# EAGLE design MainBoard (EAGLE 6.4)
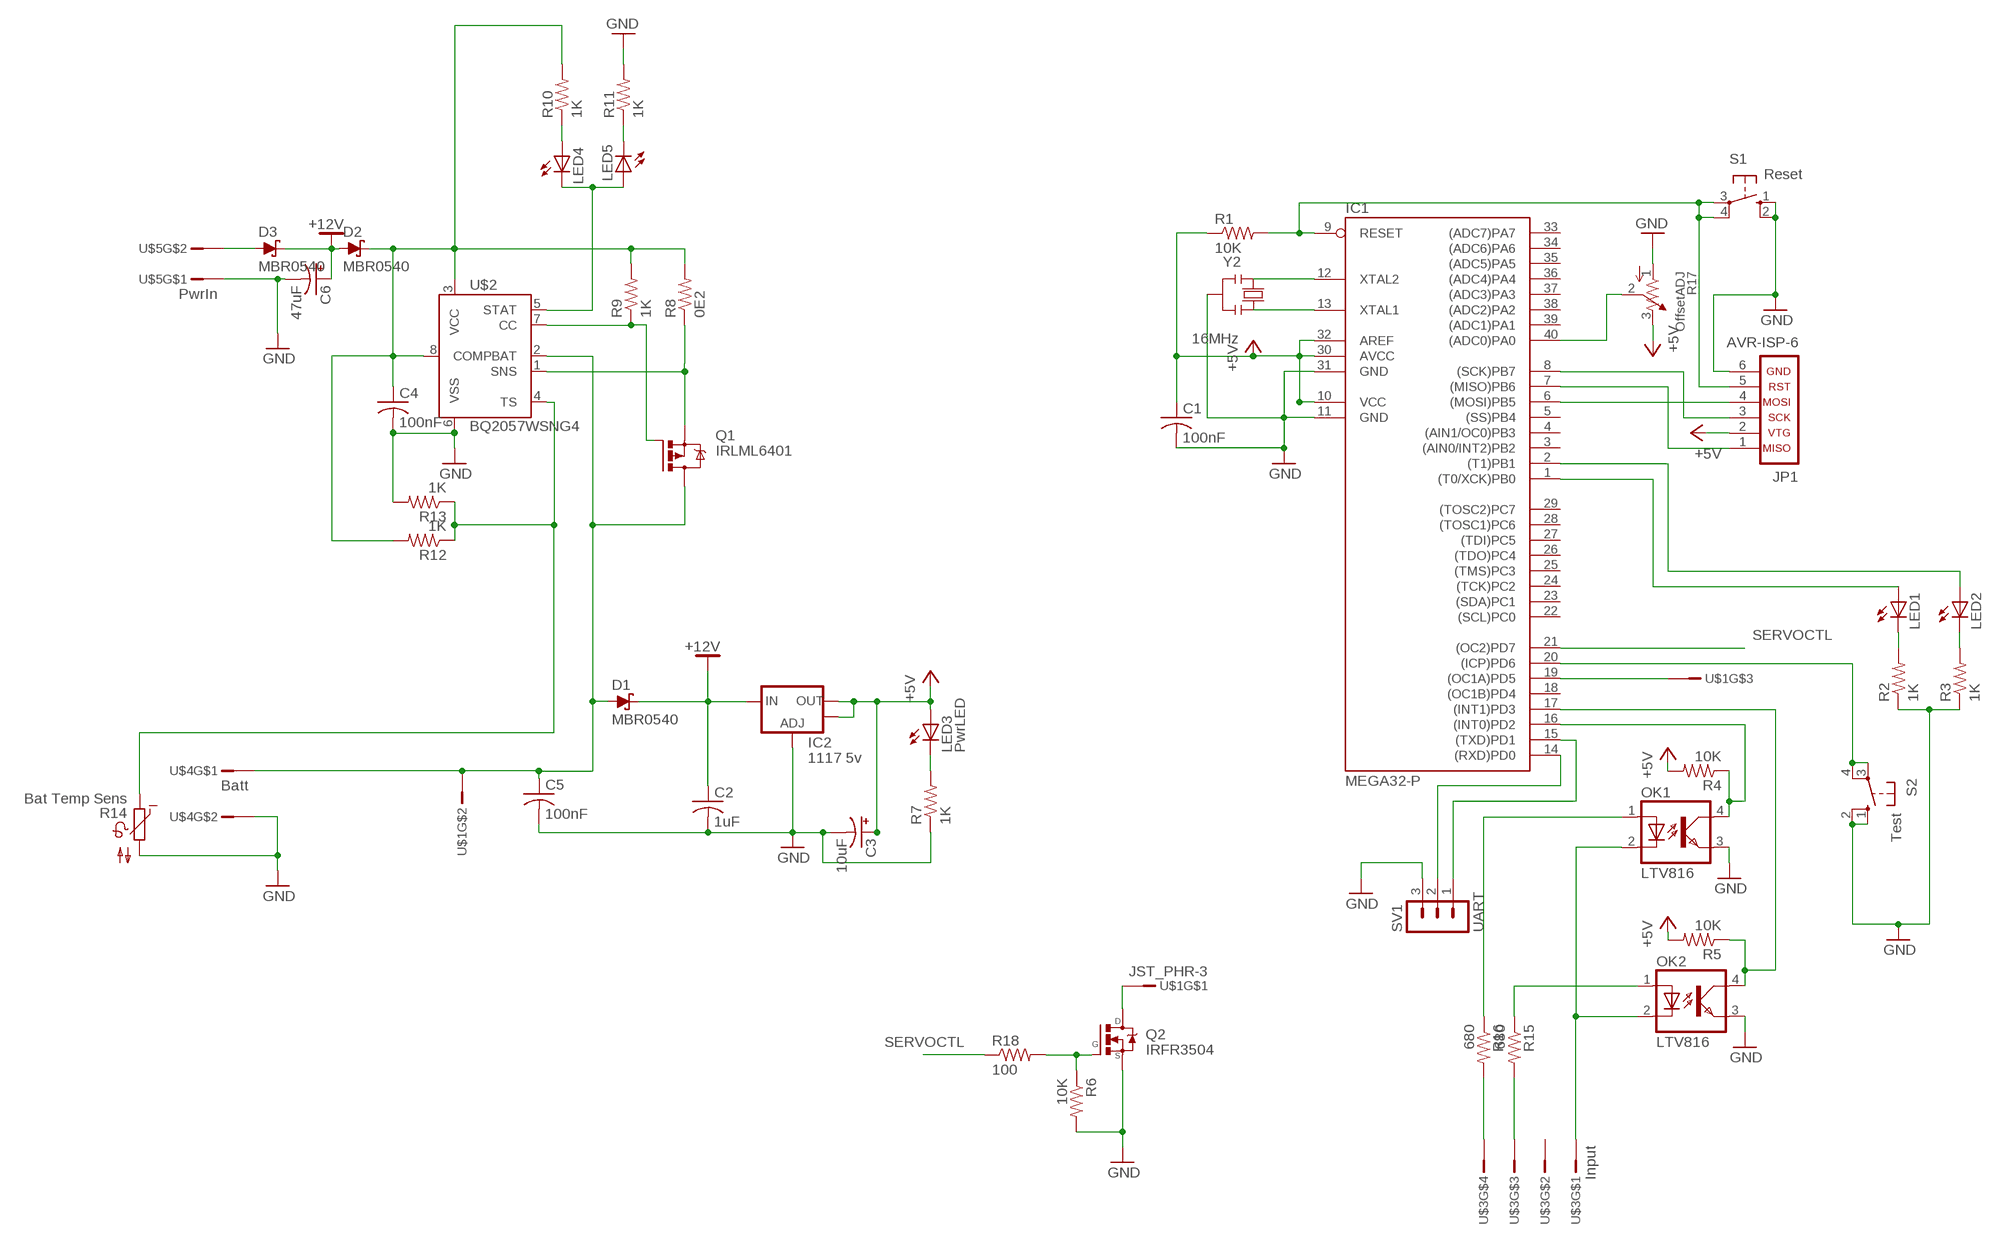
[diagram p0: schematic, sheet 1]

## Parts
C1  100nF  C-USC0805K  [C0805K]
C2  1uF  C-USC0805K  [C0805K]
C3  10uF  CPOL-USE2.5-7  [E2,5-7]
C4  100nF  C-USC0805K  [C0805K]
C5  100nF  C-USC0805K  [C0805K]
C6  47uF  CPOL-USE2.5-7  [E2,5-7]
D1  MBR0540  [SOD123]
D2  MBR0540  [SOD123]
D3  MBR0540  [SOD123]
IC1  MEGA32-P  [DIL40]
IC2  1117 5v  V_REG_LM1117SOT223  [SOT223]
JP1  AVR-ISP-6  [AVR-ISP-6]
LED1  LED3MM  [LED3MM]
LED2  LED3MM  [LED3MM]
LED3  PwrLED  LED3MM  [LED3MM]
LED4  LED3MM  [LED3MM]
LED5  LED3MM  [LED3MM]
OK1  LTV816  [DIL04]
OK2  LTV816  [DIL04]
Q1  IRLML6401  IRLML5203  [MICRO3]
Q2  IRFR3504  [DPAK]
R1  10K  R-US_R0805  [R0805]
R2  1K  R-US_R0805  [R0805]
R3  1K  R-US_R0805  [R0805]
R4  10K  R-US_R0805  [R0805]
R5  10K  R-US_R0805  [R0805]
R6  10K  R-US_R0805  [R0805]
R7  1K  R-US_R0805  [R0805]
R8  0E2  R-US_M1206  [M1206]
R9  1K  R-US_R0805  [R0805]
R10  1K  R-US_R0805  [R0805]
R11  1K  R-US_R0805  [R0805]
R12  1K  R-US_R0805  [R0805]
R13  1K  R-US_R0805  [R0805]
R14  Bat Temp Sens  NTC640  [P640]
R15  680  R-US_R0805  [R0805]
R16  680  R-US_R0805  [R0805]
R17  OffsetADJ  3362P  [3362P]
R18  100  R-US_R0805  [R0805]
S1  Reset  10-XX  [B3F-10XX]
S2  Test  10-XX  [B3F-10XX]
SV1  UART  MA03-1  [MA03-1]
U$1  JST_PHR-3  [PHR-3]
U$2  BQ2057WSNG4  [D_R-PDSO-G8]
U$3  Input  JST_PHR-4  [PHR-4]
U$4  Batt  JST_PHR-2  [PHR-2]
U$5  PwrIn  JST_PHR-2  [PHR-2]
Y2  16MHz  RESONATORMU  [RESONATOR]

## Nets
+5V: C1.1 C3.+ IC1.10(VCC) IC1.30(AVCC) IC1.32(AREF) IC2.2(OUT) IC2.4(OUT) JP1.2 LED3.A R1.1 R4.2 R5.2 R17.3
+12V: C2.1 C6.+ D1.C D2.A D3.C IC2.3(IN)
GND: C1.2 C2.2 C3.- C4.2 C5.2 C6.- IC1.11(GND) IC1.31(GND) IC2.1(ADJ) JP1.6 OK1.3(EMIT) OK2.3(EMIT) Q2.3(S) R2.1 R3.1 R6.2 R7.1 R11.2 R13.2 R14.2 R17.1 S1.1(S) S1.2(S1) S2.1(S) S2.2(S1) SV1.3 U$2.6(VSS) U$4.P$2 U$5.P$1 Y2.2
N$1: OK1.2(C) OK2.2(C) U$3.P$1
N$2: IC1.9(RESET) JP1.5 R1.2 S1.3(P) S1.4(P1)
N$3: IC1.8((SCK)PB7) JP1.3
N$4: IC1.6((MOSI)PB5) JP1.4
N$5: IC1.7((MISO)PB6) JP1.1
N$6: D3.A U$5.P$2
N$7: IC1.15((TXD)PD1) SV1.1
N$8: LED4.K(C) LED5.A U$2.5(STAT)
N$9: IC1.13(XTAL1) Y2.3
N$10: IC1.12(XTAL2) Y2.1
N$11: IC1.19((OC1A)PD5) U$1.P$3
N$12: LED1.K(C) R2.2
N$13: LED2.K(C) R3.2
N$14: IC1.14((RXD)PD0) SV1.2
N$15: IC1.1((T0/XCK)PB0) LED1.A
N$16: IC1.40((ADC0)PA0) R17.2
N$17: IC1.2((T1)PB1) LED2.A
N$18: LED3.K(C) R7.2
N$19: IC1.20((ICP)PD6) S2.3(P) S2.4(P1)
N$20: C5.1 D1.A Q1.3(D) U$1.P$2 U$2.2(BAT) U$4.P$1
N$21: Q2.1(G) R6.1 R18.2
N$22: Q2.4(D) U$1.P$1
N$27: Q1.2(S) R8.1 U$2.1(SNS)
N$29: Q1.1(G) R9.1 U$2.7(CC)
N$30: LED5.K(C) R11.1
N$31: LED4.A R10.1
N$32: R12.1 R13.1 R14.1 U$2.4(TS)
N$33: R16.2 U$3.P$4
N$34: C4.1 D2.C R8.2 R9.2 R10.2 R12.2 U$2.3(VCC) U$2.8(COMP)
N$35: IC1.17((INT1)PD3) OK2.4(COL) R5.1
N$36: IC1.16((INT0)PD2) OK1.4(COL) R4.1
N$37: R15.2 U$3.P$3
N$39: OK1.1(A) R16.1
N$40: OK2.1(A) R15.1
SERVOCTL: IC1.21((OC2)PD7) R18.1
Unconnected: IC1.3((AIN0/INT2)PB2) IC1.4((AIN1/OC0)PB3) IC1.5((SS)PB4) IC1.18((OC1B)PD4) IC1.22((SCL)PC0) IC1.23((SDA)PC1) IC1.24((TCK)PC2) IC1.25((TMS)PC3) IC1.26((TDO)PC4) IC1.27((TDI)PC5) IC1.28((TOSC1)PC6) IC1.29((TOSC2)PC7) IC1.33((ADC7)PA7) IC1.34((ADC6)PA6) IC1.35((ADC5)PA5) IC1.36((ADC4)PA4) IC1.37((ADC3)PA3) IC1.38((ADC2)PA2) IC1.39((ADC1)PA1) U$3.P$2

## Library data of the parts
C1 C2 C4 C5 = resistor:C-US: CAPACITOR, American symbol
C3 C6 = resistor:CPOL-US: POLARIZED CAPACITOR, American symbol
D1-D3 = diode:MBR0540: schottky diode, 0.5A, 40V ON Semiconductor
IC1 = atmel:MEGA32-P: MICROCONTROLLER 32 Kbytes FLASH 2 Kbytes SRAM 1 Kbytes EEPROM USART 8-channel 10 bit ADC Source: www.atmel.com .. doc2503.pdf; MPN: ATMEGA32-16PU; OC_FARNELL: 1661729; OC_NEWARK: 51P1794
IC2 = SparkFun:V_REG_LM1117: Voltage Regulator LM1117 Standard adjustable voltage regulator but in SMD form. Spark Fun Electronics SKU : COM-00595
JP1 = atmel:AVR-ISP-6: AVR ISP-6 Serial Programming Header
LED1-LED5 = led:LED: LED OSRAM: - CHIPLED LG R971, LG N971, LY N971, LG Q971, LY Q971, LO R971, LY R971 LH N974, LH R974 LS Q976, LO Q976, LY Q976 LO Q996 - Hyper CHIPLED LW Q18S LB Q993, LB Q99A, LB R99A - SideLED LS A670, LO A670, LY A670, LG A670, LP A670 LB A673, LV A673, LT A673, LW A673 LH A674 LY A675 LS A676, LA A676, LO A676, LY A676, LW A676 LS A679, LY A679, LG A679 - Hyper Micro SIDELED® LS Y876, LA Y876, LO Y876, LY Y876 LT Y87S - SmartLED LW L88C, LW L88S LB L89C, LB L89S, LG L890 LS L89K, LO L89K, LY L89K LS L896, LA L896, LO L896, LY L896 - TOPLED LS T670, LO T670, LY T670, LG T670, LP T670 LSG T670, LSP T670, LSY T670, LOP T670, LYG T670 LG T671, LOG T671, LSG T671 LB T673, LV T673, LT T673, LW T673 LH T674 LS T676, LA T676, LO T676, LY T676, LB T676, LH T676, LSB T676, LW T676 LB T67C, LV T67C, LT T67C, LS T67K, LO T67K, LY T67K, LW E67C LS E67B, LA E67B, LO E67B, LY E67B, LB E67C, LV E67C, LT E67C LW T67C LS T679, LY T679, LG T679 LS T770, LO T770, LY T770, LG T770, LP T770 LB T773, LV T773, LT T773, LW T773 LH T774 LS E675, LA E675, LY E675, LS T675 LS T776, LA T776, LO T776, LY T776, LB T776 LHGB T686 LT T68C, LB T68C - Hyper Mini TOPLED® LB M676 - Mini TOPLED Santana® LG M470 LS M47K, LO M47K, LY M47K Source: http://www.osram.convergy.de LUXEON: - LUMILED® LXK2-PW12-R00, LXK2-PW12-S00, LXK2-PW14-U00, LXK2-PW14-V00 LXK2-PM12-R00, LXK2-PM12-S00, LXK2-PM14-U00 LXK2-PE12-Q00, LXK2-PE12-R00, LXK2-PE12-S00, LXK2-PE14-T00, LXK2-PE14-U00 LXK2-PB12-K00, LXK2-PB12-L00, LXK2-PB12-M00, LXK2-PB14-N00, LXK2-PB14-P00, LXK2-PB14-Q00 LXK2-PR12-L00, LXK2-PR12-M00, LXK2-PR14-Q00, LXK2-PR14-R00 LXK2-PD12-Q00, LXK2-PD12-R00, LXK2-PD12-S00 LXK2-PH12-R00, LXK2-PH12-S00 LXK2-PL12-P00, LXK2-PL12-Q00, LXK2-PL12-R00 Source: www.luxeon.com KINGBRIGHT: KA-3528ASYC Source: www.kingbright.com
OK1 OK2 = optocoupler:LTV816: OPTO COUPLER Source: LITEON, LTV816.pdf; OC_FARNELL: unknown; OC_NEWARK: unknown
Q1 = transistor-power:IRLML5203: HEXFET P-Channel Power MOSFET
Q2 = transistor-fet:IRFR3504: N-Channel HEXFET
R1-R13 R15 R16 R18 = resistor:R-US_: RESISTOR, American symbol
R14 = ptc-ntc:NTC640: PHILIPS NTC; OC_FARNELL: unknown; OC_NEWARK: unknown
R17 = bourns:3362: 3362 Series 1/4" Square Trimmer
S1 S2 = switch-omron:10-XX: OMRON SWITCH; MPN: B3F-1000; OC_FARNELL: 176432; OC_NEWARK: 36M3542
SV1 = con-lstb:MA03-1: PIN HEADER; OC_FARNELL: unknown; OC_NEWARK: unknown
U$1 = RobThePyro:JST_PHR-3
U$2 = RobThePyro:BQ2057WSNG4: TI BQ2057WSNG4 1-2Cell Li-ion / lipo charger IC http://www.ti.com/lit/ds/symlink/bq2057w.pdf
U$3 = RobThePyro:JST_PHR-4
U$4 U$5 = RobThePyro:JST_PHR-2
Y2 = SmartPrj:RESONATOR

## Net classes
0 default: width 0.152 mm, drill 0.305 mm, clearance 0.152 mm

## Board
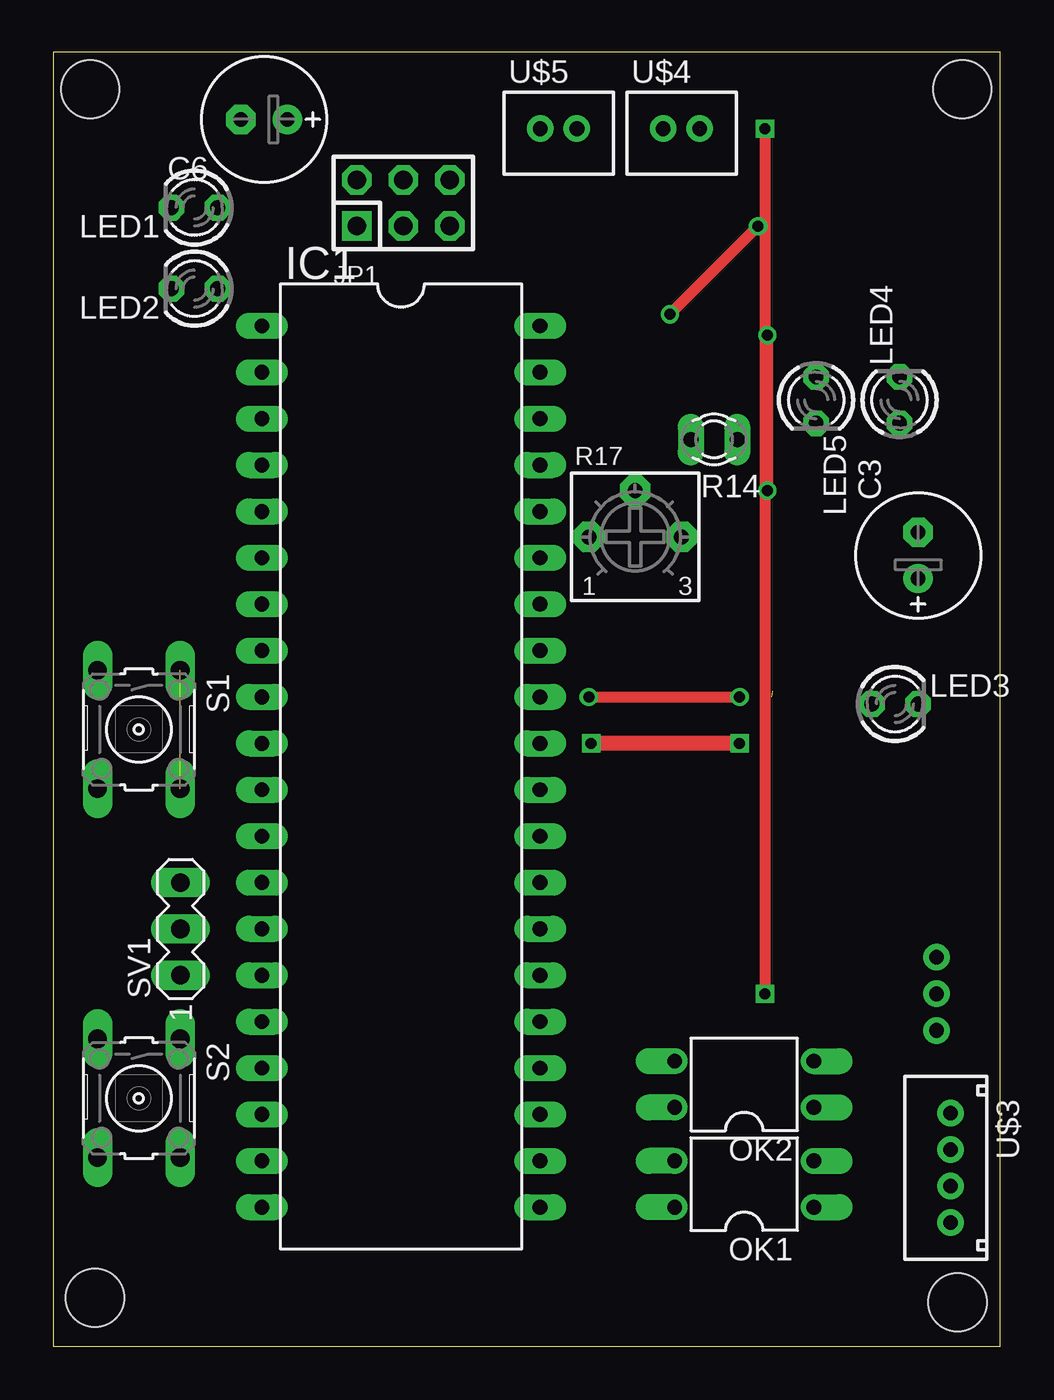
[diagram p1: board, top side]
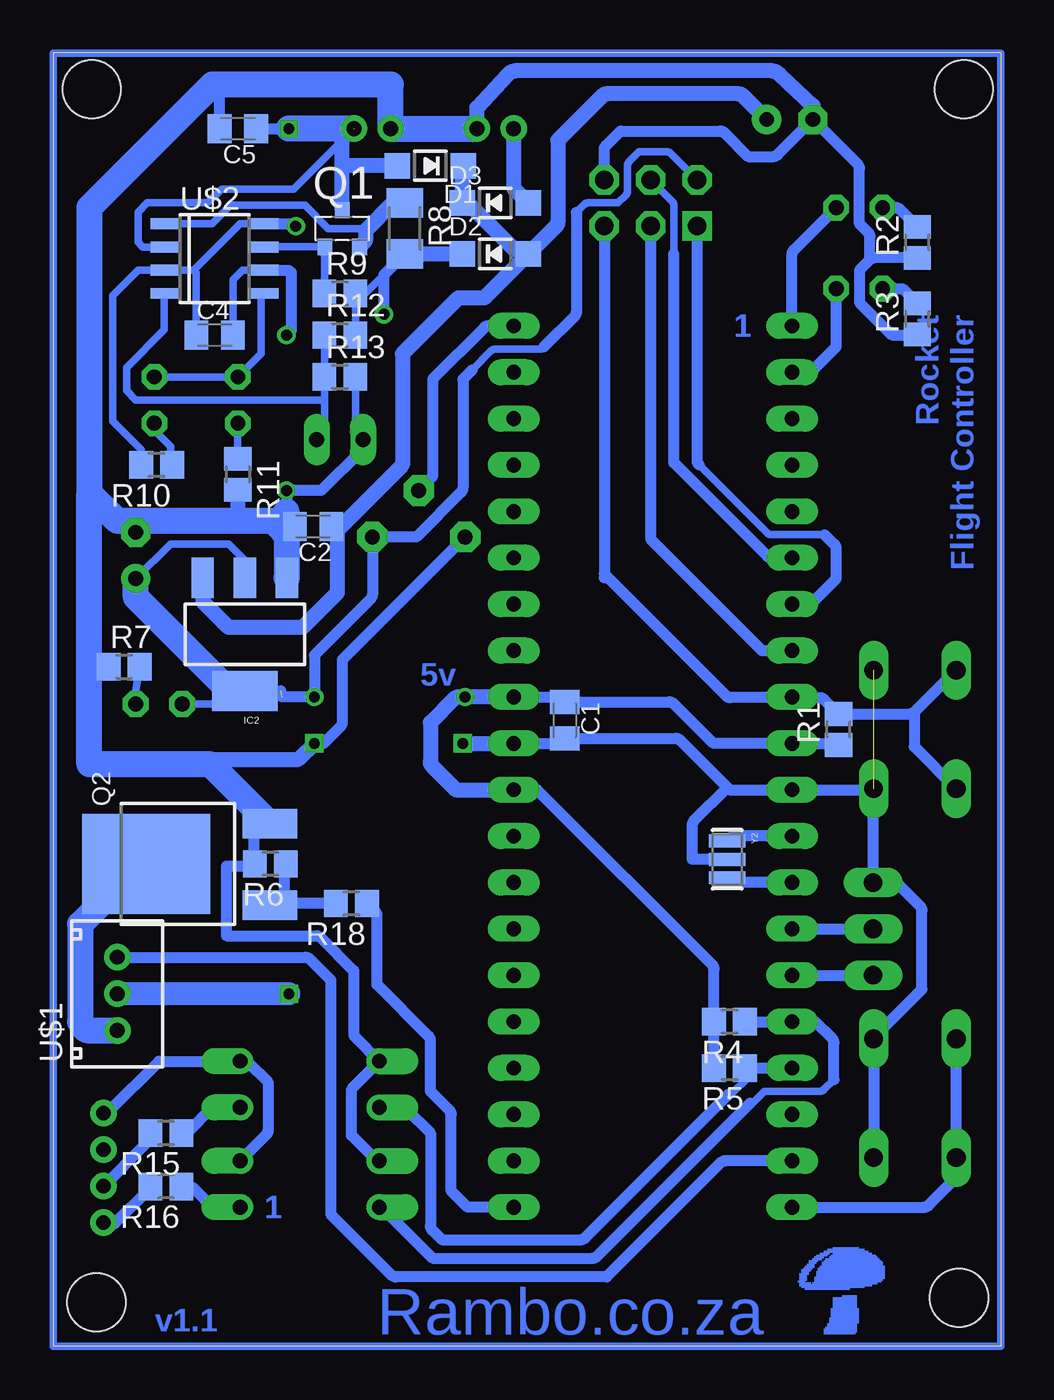
[diagram p2: board, bottom side, seen from below]

Size 51.87 x 70.86 mm. Coordinates in mm from the lower left corner, seen from the top.
Outline: 0,0 51.87,0 51.87,70.86 0,70.86 0,0
Copper layers (1*16): Top 0.035mm / dielectric 1.5mm / Bottom 0.035mm
Design rules "default *": minimum track width 10mil, minimum drill 24mil, track to track 8mil, track to pad 8mil, pad to pad 8mil, via to via 8mil, smd to smd 8mil, copper to edge 40mil, drill to drill 8mil, minimum pad ring 0.3mm, minimum via ring 8mil, stop-mask expansion 4mil, vias tented up to drill 0mil, thermal gap 10mil
Holes 3.2 mm at 2.03,68.83 49.78,68.83 2.29,2.67 49.53,2.41

### Footprints (pad centres in the part's own frame; a part is rotated, then mirrored left to right if it is on the bottom)
C0805K = smd 1.3 x 1.6: 1 -1,0; 2 1,0
E2,5-7 = drill 0.813 pad 1.6: + -1.27,0 | drill 0.813 pad 1.6 octagon: - 1.27,0
SOD123 = smd 1.4 x 1.4: A 1.805,0; C -1.805,0
DIL40 = drill 0.813 long: 1 -24.13,-7.62; 2 -21.59,-7.62; 3 -19.05,-7.62; 4 -16.51,-7.62; 5 -13.97,-7.62; 6 -11.43,-7.62; 7 -8.89,-7.62; 8 -6.35,-7.62; 9 -3.81,-7.62; 10 -1.27,-7.62; 11 1.27,-7.62; 12 3.81,-7.62; 13 6.35,-7.62; 14 8.89,-7.62; 15 11.43,-7.62; 16 13.97,-7.62; 17 16.51,-7.62; 18 19.05,-7.62; 19 21.59,-7.62; 20 24.13,-7.62; 21 24.13,7.62; 22 21.59,7.62; 23 19.05,7.62; 24 16.51,7.62; 25 13.97,7.62; 26 11.43,7.62; 27 8.89,7.62; 28 6.35,7.62; 29 3.81,7.62; 30 1.27,7.62; 31 -1.27,7.62; 32 -3.81,7.62; 33 -6.35,7.62; 34 -8.89,7.62; 35 -11.43,7.62; 36 -13.97,7.62; 37 -16.51,7.62; 38 -19.05,7.62; 39 -21.59,7.62; 40 -24.13,7.62
SOT223 = smd 1.219 x 2.235: 1 -2.311,-3.099; 2 0,-3.099; 3 2.311,-3.099 | smd 3.6 x 2.2: 4 0,3.099
AVR-ISP-6 = drill 1.016 square: 1 -2.54,-1.27 | drill 1.016 octagon: 2 -2.54,1.27; 3 0,-1.27; 4 0,1.27; 5 2.54,-1.27; 6 2.54,1.27
LED3MM = drill 0.813 octagon: A -1.27,0; K 1.27,0
DIL04 = drill 0.813 offset: 1 -1.27,-3.81; 2 1.27,-3.81; 3 1.27,3.81; 4 -1.27,3.81
MICRO3 = smd 0.8 x 0.9: 1 -0.95,-1; 2 0.95,-1; 3 0,1
DPAK = smd 1.6 x 2.997: 1 -2.261,-4.928; 3 2.21,-4.928 | smd 5.452 x 7: 4 0,1.853
R0805 = smd 1.3 x 1.5: 1 -0.85,0; 2 0.85,0
M1206 = smd 1.6 x 2: 1 -1.4,0; 2 1.4,0
P640 = drill 0.813 long: 1 -1.27,0; 2 1.27,0
3362P = drill 0.813 pad 1.676 octagon: 1 -2.54,0; 2 0,2.54; 3 2.54,0
B3F-10XX = drill 1.016 long: 1 -3.251,2.261; 2 3.251,2.261; 3 -3.251,-2.261; 4 3.251,-2.261
MA03-1 = drill 1.016 long: 1 -2.54,0; 2 0,0; 3 2.54,0
PHR-3 = drill 0.8 pad 1.45: P$1 -2,0; P$2 0,0; P$3 2,0
D_R-PDSO-G8 = smd 0.6 x 1.5: 1 -1.905,-2.75; 2 -0.635,-2.75; 3 0.635,-2.75; 4 1.905,-2.75; 5 1.905,2.75; 6 0.635,2.75; 7 -0.635,2.75; 8 -1.905,2.75
PHR-4 = drill 0.8 pad 1.45: P$1 -3,0.5; P$2 -1,0.5; P$3 1,0.5; P$4 3,0.5
PHR-2 = drill 0.8 pad 1.45: P$1 1,0; P$2 -1,0
RESONATOR = smd 0.7 x 2: 1 -1,0; 2 0,0; 3 1,0

### Placement (x,y rotation side)
C1  23.88,34.29 270 bottom
C2  37.66,44.89 180 bottom
C3  47.37,43.31 90 top
C4  43.05,55.37 0 bottom
C5  41.78,66.67 180 bottom
C6  11.56,67.18 180 top
D1  31.24,64.64 180 bottom
D2  27.69,59.82 0 bottom
D3  27.69,62.61 0 bottom
IC1  19.05,31.75 270 top
IC2  41.4,38.99 180 bottom
JP1  19.18,62.61 0 top
LED1  7.75,62.36 180 top
LED2  7.75,57.91 180 top
LED3  46.1,35.18 0 top
LED4  46.35,51.82 90 top
LED5  41.78,51.82 270 top
OK1  37.85,8.89 90 top
OK2  37.85,14.35 90 top
Q1  36.07,61.21 0 bottom
Q2  44.96,26.42 90 bottom
R1  8.89,33.78 90 bottom
R2  4.57,60.45 90 bottom
R3  4.57,56.26 90 bottom
R4  14.86,17.78 180 bottom
R5  14.86,15.24 180 bottom
R6  40.01,26.42 180 bottom
R7  48.01,37.21 0 bottom
R8  32.64,61.21 270 bottom
R9  36.2,57.66 0 bottom
R10  46.23,48.26 180 bottom
R11  41.78,47.75 270 bottom
R12  36.2,55.37 0 bottom
R13  36.2,53.09 0 bottom
R14  36.2,49.66 180 top
R15  45.72,11.68 180 bottom
R16  45.72,8.76 180 bottom
R17  31.88,44.32 0 top
R18  35.56,24.26 180 bottom
S1  4.7,33.78 270 top
S2  4.7,13.59 270 top
SV1  6.99,22.86 90 top
U$1  48.39,19.3 90 bottom
U$2  43.05,59.56 270 bottom
U$3  48.64,9.78 270 top
U$4  34.42,66.67 0 top
U$5  27.69,66.67 0 top
Y2  14.99,26.67 270 bottom

### Tracks (layer width: path | path; a pad name or v marks a point on that pad's centre or on a via)
+5V  (via drill 0.6)  (1 unrouted)
  Top 0.61: v29.34,35.56 v37.59,35.56
  Bottom 0.406: 27.94,35.56 IC1.32 | 24.13,35.54 C1.1 24.15,35.56 | IC2.2 41.4,43.05 42.29,43.94 45.47,43.94 C3.+ | LED3.A 42.11,35.18 IC2.4 | JP1.2 18.07,65.31 arc-45 18.29,65.41 19.81,65.41 20.35,64.86 arc-45 20.45,64.64 20.45,63.25 arc45 20.54,63.03 20.95,62.61 22.6,62.61 arc-45 22.83,62.52 23.24,62.1 | 28.96,53.47 27.91,54.52 arc45 27.68,54.61 25.15,54.61 25.02,54.74
  Bottom 0.61: IC2.4 39.42,35.89 | 27.94,35.56 v29.34,35.56 29.21,35.43 | 39.37,35.56 v37.59,35.56 37.59,37.85 34.51,40.93 arc-45 34.42,41.15 R17.3 32,44.32 29.56,46.77 arc-45 29.46,46.99 29.46,52.96 28.96,53.47 | R5.2 R4.2 15.71,20.66 arc-45 15.8,20.88 25.4,30.48 IC1.30 | R1.1 arc-45 9.1,33.02 IC1.10 15.62,33.02 arc45 15.84,33.11 17.93,35.2 arc-45 18.15,35.29 C1.1 24.05,35.47 arc-45 24.28,35.56 IC1.32 | 23.24,62.1 23.24,56.65 arc45 23.33,56.42 25.02,54.74
  Bottom 0.813: IC1.32 29.71,35.56 arc-45 29.94,35.47 31.24,34.16 31.24,32.01 arc-45 31.15,31.78 29.84,30.48 IC1.30
  Bottom 1.422: IC2.4 42.24,35.89 47.37,41.02 C3.+
+12V
  Bottom 0.406: C2.1 36.51,44.9 36.32,44.7
  Bottom 0.813: D2.A 26.14,60.07 26.67,60.07 29.21,62.61 D3.C 29.49,64.59 D1.C | 43.71,42.06 IC2.3 43.69,42.06 43.69,40.77 42.29,39.37 38.23,39.37 36.32,41.27 36.32,44.7 32.77,48.26 32.77,54.36 29.72,57.4 28.29,57.4 D2.A | D2.A 24.35,61.35 arc-45 24.26,61.57 24.26,66.04 21.81,68.49 arc45 21.59,68.58 14.36,68.58 arc45 14.13,68.49 C6.+
GND  (via drill 0.6)  (1 unrouted)
  Top 0.61: v39.12,55.37 v39.12,46.86
  Top 0.813: v37.59,33.02 v29.46,33.02
  Bottom 0.406: 24.15,33.02 C1.2 | U$2.6 41.53,58.93 42.04,58.42 42.04,55.39 C4.2 | R13.2 35.34,50.08 | 39.16,46.9 v39.12,46.86 | C2.2 39.05,44.9 39.31,44.64
  Bottom 0.61: U$2.6 38.99,58.93 38.86,58.8 38.86,55.63 v39.12,55.37 | 39.12,45.72 v39.12,46.86 37.21,46.86 35.02,49.06 arc-45 34.92,49.28 R14.2 35.34,50.08 | JP1.6 21.72,65.53 arc45 21.62,65.75 20.83,66.55 15.37,66.55 arc45 15.15,66.45 13.84,65.15 12.45,65.15 arc-45 12.23,65.24 C6.- 7.84,64.74 arc45 7.75,64.51 7.75,61.47 7.26,60.98 arc45 7.17,60.76 7.17,59.51 | C5.2 42.78,68.84 arc45 42.69,69.07 42.67,69.09 | 24.28,33.02 arc-45 24.05,33.11 | R2.1 6.94,59.6 arc-45 7.17,59.51 | 7.17,59.51 7.75,58.93 7.75,57.28 arc-45 7.65,57.06 5.97,55.37 4.67,55.37 arc-45 R3.1 | OK1.3 arc45 34.25,10.25 35.56,11.56 35.56,13.96 arc45 35.47,14.19 OK2.3 35.34,16.93 arc45 35.43,17.15 35.43,20.57 37.24,22.39 arc-45 37.47,22.48 42.42,22.48 42.42,26.29 41.11,26.29 arc-45 40.89,26.38 R6.2 arc45 40.89,26.51 40.89,28.32 40.68,28.53 arc45 40.46,28.63 Q2.3 | 43.43,32.13 arc-45 43.65,32.04 43.81,31.88 | IC1.31 24.28,33.02 | 24.28,33.02 arc-45 24.05,33.11 | 24.05,33.11 C1.2 17.8,33.29 arc45 17.58,33.2 14.99,30.61 | 14.99,30.61 14.86,30.48 IC1.11 7.08,30.48 arc-45 S1.2 arc-45 6.99,30.47 SV1.3 5.71,25.4 4.41,24.1 arc45 4.32,23.87 4.32,19.56 6.91,16.97 arc-45 S2.1 S2.2 | R17.1 36.07,37.59 36.07,34.17 arc45 36.16,33.94 37.08,33.02 v37.59,33.02 | Y2.2 16.89,26.67 16.89,28.57 arc45 16.8,28.8 14.99,30.61
  Bottom 0.813: R11.2 41.78,45.34 41.66,45.21 | U$5.P$1 28.69,67.83 27.02,69.63 arc45 26.54,69.85 12.58,69.85 arc45 12.1,69.63 10.29,67.94 C6.- | R7.1 49.91,37.21 | 43.43,32.13 38.61,32.13 arc-45 38.39,32.22 v37.59,33.02 | v29.46,33.02 IC1.31
  Bottom 1.422: 39.18,44.51 39.31,44.64 39.88,45.21 41.66,45.21 46.99,45.21 | 39.18,44.51 39.12,44.45 39.12,42.11 IC2.1 | 39.12,45.72 39.12,44.58 39.18,44.51 | 46.99,45.21 48.39,45.21 49.91,46.74 | C3.- 47.37,44.83 46.99,45.21 | 49.91,46.74 49.91,62.36 43.18,69.09 42.67,69.09 33.4,69.09 33.42,69.07 U$4.P$2 U$5.P$1 | Q2.3 43.19,31.78 arc-45 43.41,31.88 43.81,31.88 49.91,31.88 49.91,37.21 49.91,46.74
N$1
  Bottom 0.61: OK1.2 40.23,11.59 arc-45 40.13,11.82 40.13,14.48 41.18,15.53 arc-45 41.41,15.62 OK2.2 46.1,15.62 48.85,12.87 arc45 49.08,12.78 U$3.P$1
N$2
  Bottom 0.61: JP1.5 21.72,42.29 | 21.72,42.29 21.72,42.08 | 11.52,35.52 arc-45 IC1.9 | 11.52,35.52 9.91,35.52 arc45 9.69,35.43 R1.2 4.97,34.63 arc-45 4.75,34.73 | 4.75,34.73 S1.3 | 11.52,35.52 14.81,35.52 arc45 15.04,35.61 21.72,42.29 | 4.75,34.73 4.75,32.84 S1.4
N$3
  Bottom 0.61: JP1.3 19.18,44.33 arc-45 19.08,44.1 13.08,38.1 IC1.8
N$4
  Bottom 0.406: 17.91,59.82 17.91,62.48 arc-45 18,62.7 JP1.4
  Bottom 0.61: IC1.6 12.57,43.18 arc45 12.79,43.27 17.91,48.39 17.91,59.82
N$5
  Bottom 0.406: 9.65,44.45 12.57,44.45 arc45 12.79,44.54 16.51,48.26
  Bottom 0.61: JP1.1 16.64,48.52 arc-45 16.54,48.29 16.51,48.26 | IC1.7 10.55,40.64 arc-45 10.32,40.73 9.02,42.04 9.02,43.68 arc-45 9.11,43.91 9.65,44.45
N$6
  Bottom 0.813: U$5.P$2 26.69,63.42 D3.A
N$7
  Bottom 0.61: IC1.15 SV1.1
N$8
  Bottom 0.406: LED4.K LED5.A 40.51,54.36 40.51,57.45 U$2.5
N$9
  Bottom 0.61: IC1.13 14.58,25.4 arc45 14.81,25.49 Y2.3
N$10
  Bottom 0.61: IC1.12 14.58,27.94 arc-45 14.81,27.85 Y2.1
N$11
  Bottom 0.61: IC1.19 15.11,10.16 arc-45 15.33,10.07 21.59,3.81 33.14,3.81 arc45 33.37,3.9 36.7,7.24 36.7,20.07 37.85,21.21 arc-45 38.07,21.3 U$1.P$3
N$12
  Bottom 0.61: LED1.K 5.76,62.36 arc45 5.53,62.26 R2.2
N$13
  Bottom 0.61: LED2.K 5.37,57.91 R3.2
N$14
  Bottom 0.61: IC1.14 SV1.2
N$15
  Bottom 0.61: IC1.1 11.43,59.81 arc45 11.34,60.04 LED1.A
N$16
  Bottom 0.61: IC1.40 28.06,55.88 arc-45 28.29,55.79 31.11,52.96 31.11,47.76 arc45 31.21,47.53 R17.2
N$17
  Bottom 0.61: IC1.2 10.67,53.34 arc-45 10.45,53.43 arc-45 10.23,53.52 9.02,54.74 LED2.A
N$18
  Bottom 0.406: LED3.K 47.37,35.85 R7.2
N$19
  Bottom 0.61: IC1.20 4.2,7.62 arc-45 3.97,7.71 2.54,9.14 2.54,10.11 arc45 S2.4 | S2.4 | S2.4 S2.3
N$20  (via drill 0.6)  (1 unrouted)
  Top 0.61: v38.99,66.67 v38.99,19.3
  Bottom 0.406: 36.07,64.52 36.07,66.04 35.43,66.67 | U$2.2 46.99,60.2 47.24,60.45 47.24,62.1 46.74,62.61 43.43,62.61 42.67,63.37 38.72,63.37 U$4.P$1
  Bottom 0.61: C5.1 v38.99,66.67
  Bottom 0.813: Q1.3 36.07,64.52 | 36.07,64.52 36.07,66.02 | D1.A 35.94,64.64 36.07,64.52
  Bottom 1.27: v38.99,19.3 U$1.P$2
  Bottom 1.422: 35.43,66.67 v38.99,66.67
N$21
  Bottom 0.61: R6.1 arc-45 39.24,26.2 39.24,24.26 39.25,24.25 arc45 39.48,24.16 Q2.1 Q2.1 arc45 39.8,24.26 R18.2
N$22
  Bottom 0.61: 50.42,17.79 50.42,17.65 50.33,17.56
  Bottom 1.422: Q2.4 46.98,26.42 arc-45 47.21,26.32 50.42,23.11 50.42,17.79 | 50.33,17.56 50.16,17.4 arc-45 49.94,17.3 U$1.P$1
N$23
  Bottom 0.406: 0,0 0,70.81 51.8,70.81 51.8,70.8 51.9,70.8 51.9,0 0,0
N$27
  Bottom 0.406: U$2.1 43.18,61.47 42.16,62.48 38.1,62.48 36.83,61.21 34.92,61.21 34.8,61.09
  Bottom 0.813: R8.1 33.27,62.61 34.8,61.09 34.8,60.53 Q1.2
N$29
  Bottom 0.406: R9.1 37.02,57.66 Q1.1 40.3,60.21 U$2.7
N$30
  Bottom 0.406: LED5.K R11.1
N$31
  Bottom 0.406: LED4.A 46.35,50.16 45.47,49.28 45.47,48.35 R10.1
N$32
  Bottom 0.406: R12.1 R13.1 37.05,51.69 | 37.05,51.69 37.05,50.08 R14.1 | U$2.4 45.8,55.67 47.88,53.59 47.88,52.32 47.37,51.82 37.17,51.82 37.05,51.69
N$33
  Bottom 0.61: 48.69,6.78 U$3.P$4 arc-45 49.02,6.73 48.51,6.73 46.63,8.61 arc-45 R16.2
N$34  (via drill 0.6)
  Top 0.61: v38.61,61.34 v33.78,56.52
  Bottom 0.406: R8.2 34.8,57.66 R9.2 R12.2 | 44.2,58.93 U$2.3 47.24,58.93 48.64,57.53 48.64,50.67 47.08,49.11 R10.2 | 44.2,58.93 41.66,61.47 U$2.8 | C4.1 44.05,58.78 44.2,58.93
  Bottom 0.61: U$2.8 38.73,61.47 v38.61,61.34 | v33.78,56.52 33.78,58.67 R8.2
  Bottom 0.813: D2.C R8.2
N$35
  Bottom 0.406: 14.86,13.84 arc-45 14.64,13.93 13.97,14.61 13.97,15.15 arc-45 R5.1
  Bottom 0.61: R5.1 IC1.17 | OK2.4 32.77,13.08 arc45 32.55,12.99 31.24,11.68 31.24,6.61 arc-45 31.15,6.38 30.61,5.84 22.99,5.84 arc-45 22.77,5.93 14.86,13.84
N$36
  Bottom 0.406: 13.72,13.34 arc-45 13.5,13.43 12.95,13.97 9.91,13.97 arc-45 9.69,14.06 9.14,14.61
  Bottom 0.61: R4.1 IC1.16 10.16,17.78 9.24,16.86 arc45 9.14,16.63 9.14,14.61 | OK1.4 arc45 33.82,7.53 31.11,4.83 22.36,4.83 arc-45 22.13,4.92 13.72,13.34
N$37
  Bottom 0.61: R15.2 46.61,11.68 arc-45 46.84,11.59 46.84,11.21 arc45 46.93,10.99 U$3.P$3
N$39
  Bottom 0.61: R16.1 44.45,8.76 arc45 44.23,8.67 43.05,7.49 41.91,7.49 arc-45 41.69,7.59 OK1.1
N$40
  Bottom 0.61: R15.1 44.71,11.68 arc-45 44.48,11.78 43.18,13.08 OK2.1
SERVOCTL
  Bottom 0.61: IC1.21 29.08,7.62 arc45 29.3,7.71 30.1,8.51 30.1,12.7 arc-45 30.19,12.92 31.24,13.97 31.24,16.76 arc-45 31.34,16.98 34.16,19.81 34.16,23.58 arc-45 34.26,23.8 R18.1
(copper drawn outside any net)
  shapes: Bottom area x61, Bottom circle x4

### Text on the board
Bottom: Rocket / Flight Controller | 1 | 5v | 1 | Rambo.co.za | v1.1